# Altium schematic sheet 01_Power.SchDoc
size A4; SheetNumber: 1; SheetTotal: 5
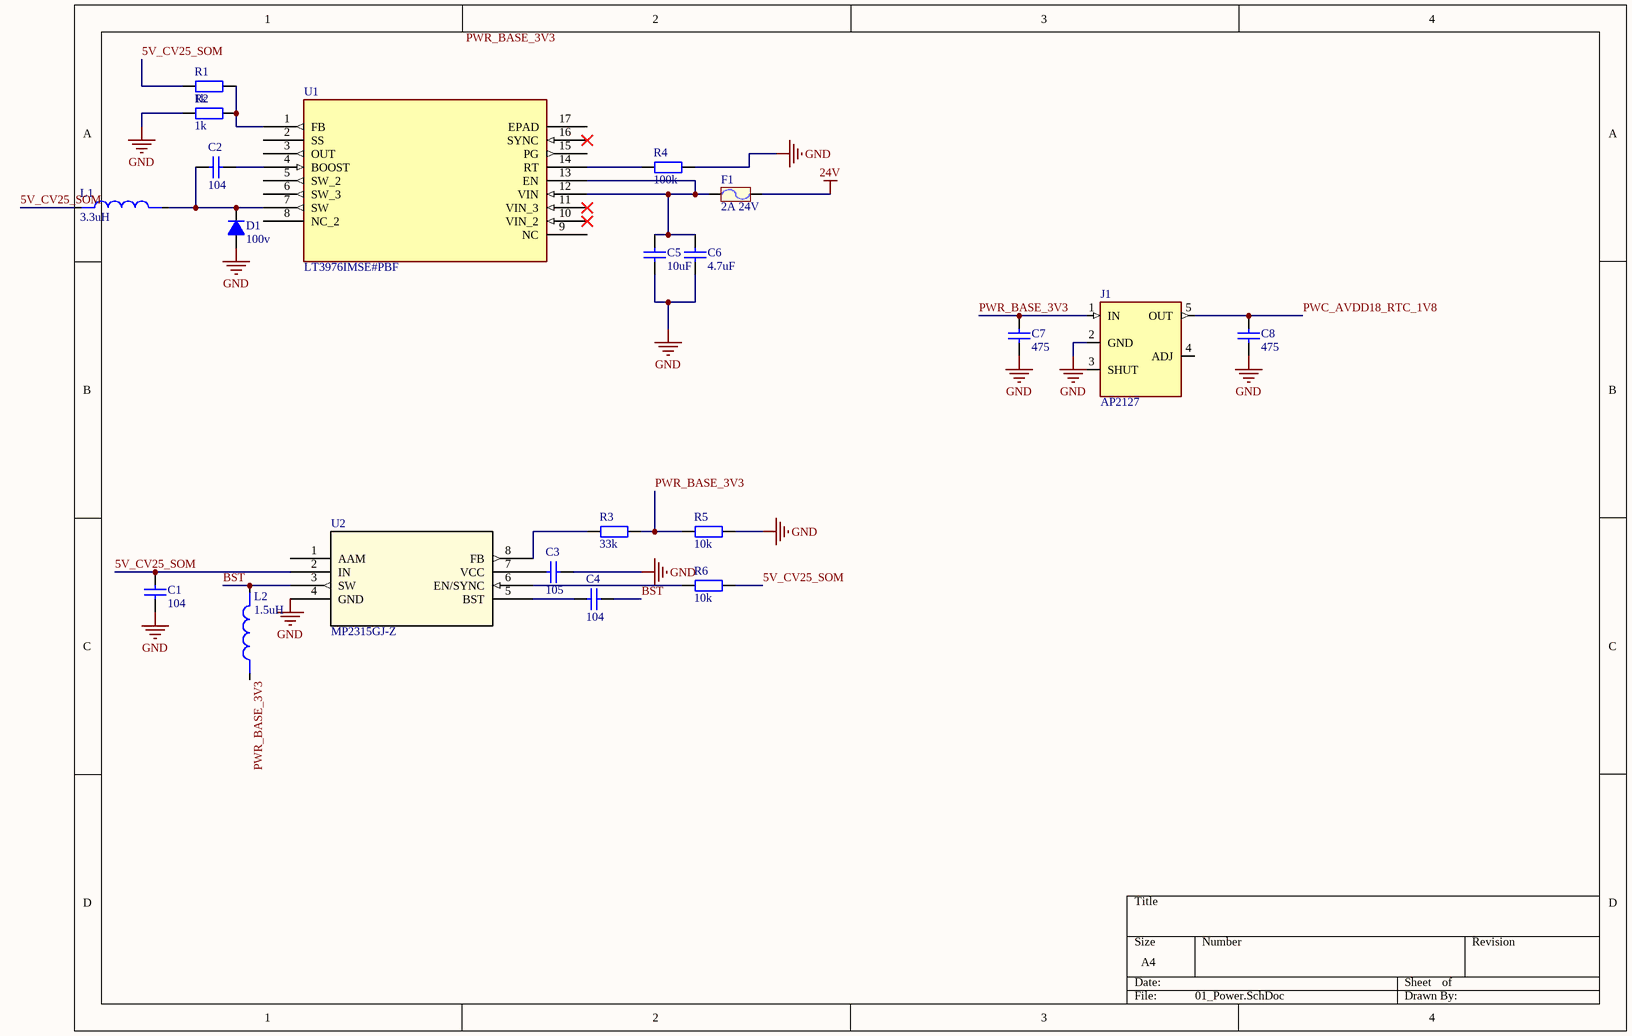
[diagram p0: 01_Power.SchDoc]

## Parts
C1  104  [tu 0603]
C2  104  [tu 0603]
C3  105  [tu 0603]
C4  104  [tu 0603]
C5  10uF  [tu 0603]
C6  4.7uF  [tu 0603]
C7  475  [tu 0805]
C8  475  [tu 0805]
D1  100v  [DIODE 1A]
F1  2A 24V  [Cau chi tu phuc hoi 2A 24V SMD1812]
J1  AP2127  [AP2127K-3.3]
L1  3.3uH  [CUON CAM SMD 0530]
L2  1.5uH  [CUON CAM SMD 0530]
R1  1k  [tro smd 0603]
R2  1k  [tro smd 0603]
R3  33k  [Tro smd 0603]
R4  100k  [tro smd 0805]
R5  10k  [tro smd 0603]
R6  10k  [tro smd 0603]
U1  LT3976IMSE#PBF  [MSOP-16_MSE]
U2  MP2315GJ-Z  [TSOT23-8_MPS]

## Nets
24V: F1.2
GND: C1.2 C3.1 C5.1 C6.1 C7.2 C8.2 D1.1(A) J1.2(GND) R2.1 R4.2 R5.2 U2.4(GND)
5V_CV25_SOM: C1.1 L1.1 R1.1 R6.2 U2.2(IN)
BST: C4.1 L2.2 U2.3(SW)
PWC_AVDD18_RTC_1V8: C8.1 J1.5(OUT)
PWR_BASE_3V3: C7.1 J1.1(IN) L2.1 R3.2 R5.1
NetC2_1: C2.1 U1.4(BOOST)
NetC2_2: C2.2 D1.2(K) L1.2 U1.7(SW)
NetC3_2: C3.2 U2.7(VCC)
NetC4_2: C4.2 U2.5(BST)
NetC5_2: C5.2 C6.2 F1.1 U1.12(VIN) U1.13(EN)
NetR1_2: R1.2 R2.2 U1.1(FB)
NetR3_1: R3.1 U2.8(FB)
NetR4_1: R4.1 U1.14(RT)
NetR6_1: R6.1 U2.6(EN/SYNC)

Not connected (* = marked no-connect by the designer): J1 3(SHUT) 4(ADJ); U1 2(SS) 3(OUT) 5(SW_2) 6(SW_3) 8(NC_2) 9(NC) 10(VIN_2)* 11(VIN_3)* 15(PG) 16(SYNC)* 17(EPAD); U2 1(AAM)

## Notes on the sheet
- Labels drawn without touching a wire or pin: PWR_BASE_3V3

## Library data of the parts
C1 C2 C4 = Tu 0603 104 50V 10%: Dán; Don_Vi: Con; So_Chan: 2; Ten_Linh_Kien: Tụ 0603 104-100nF 10% 50V; Ma_Hang: MH004568; Chung_Loai: Dán; Kieu_Chan: *
C3 = Tu 0603 105 16V 20%: Dán; Don_Vi: Con; So_Chan: 2; Ten_Linh_Kien: Tụ 0603 105-1uF 20% 16V; Ma_Hang: MH004574; Chung_Loai: Dán; Kieu_Chan: *
C5 C6 = Tu 0603 470pF 50V 10%: Dán; Don_Vi: Con; So_Chan: 2; Ten_Linh_Kien: Tụ 0603 470P 50V 10%; Ma_Hang: MH004571; Chung_Loai: Dán; Kieu_Chan: *
C7 C8 = Tu 0805 475 25V 20%: Dán; Don_Vi: Con; So_Chan: 2; Ten_Linh_Kien: Tụ 0805 475-4.7uF 20% 25V; Ma_Hang: MH004276; Chung_Loai: Dán; Kieu_Chan: *
D1 = Diode 1N4007: Cắm; Ten_Linh_Kien: Diode 1N4007 1A (DIP); Don_Vi: Con; Ma_Hang: MH001063; Ghi Chu: *; Kieu_Chan: *; Chung_Loai: Cắm
F1 = Cau chi tu phuc hoi 2A 24V SMD1812: 2A 24V SMD1812; Ma_Hang: MH010033; Ten: Cầu Chì Tự Phục Hồi 2A 24V SMD1812
J1 = AP2127: LDO Regulator Pos 1.8V 0.4A 5-Pin SOT-23 T/R / IC REG LDO 1.8V 0.3A SOT23-5; MF: Diodes Incorporated; SnapEDA_Link: https://www.snapeda.com/parts/AP2127/EDTM+Incorporated/view-part/?ref=snap; Package: None; Value: *; MP: AP2127; Check_prices: https://www.snapeda.com/parts/AP2127/EDTM+Incorporated/view-part/?ref=eda
L1 L2 = Cuon Cam SMD 0530: SMD 0530; MP: FDV0530-H-1R5M=P3; Package: None; Price: None; Value: *; Availability: Unavailable
R1 R2 = Tro 0603 1% 1k: Dán; So_Chan: 2; Don_Vi: Con; Ten_Linh_Kien: Trở 0603 1% 1k; Ma_Hang: MH006334; Chung_Loai: Dán; Kieu_Chan: *
R3 = Tro 0603 1% 33k: Dán; Don_Vi: Con; So_Chan: 2; Ten_Linh_Kien: Trở 0603 1% 33k; Ma_Hang: MH006335; Chung_Loai: Dán; Kieu_Chan: *
R4 = Tro 0805 5% 100k: Dán; Don_Vi: Con; So_Chan: 2; Ten_Linh_Kien: Trở 0805 5% 100k; Ma_Hang: MH005250; Chung_Loai: Dán; Kieu_Chan: *
R5 R6 = Tro 0603 1% 10k: Dán; Don_Vi: Con; So_Chan: 2; Ten_Linh_Kien: Trở 0603 1% 10k; Ma_Hang: MH006333; Chung_Loai: Dán; Kieu_Chan: *
U1 = LT3976IMSE#PBF: 40V, 5A, 2MHz Step-Down Switching Regulator with 3.3Î¼A Quiescent Current; MF: Analog Devices; Value: *; Price: None; Package: MSOP -16 Analog Devices; MP: LT3976IMSE#PBF; Purchase-URL: https://pricing.snapeda.com/search/part/LT3976IMSE#PBF/?ref=eda; SnapEDA_Link: https://www.snapeda.com/parts/LT3976IMSE%23PBF/Analog+Devices/view-part/?ref=snap; Check_prices: https://www.snapeda.com/parts/LT3976IMSE%23PBF/Analog+Devices/view-part/?ref=eda; Availability: In Stock
U2 = MP2315GJ-Z: High Efficiency 3A 24V 500kHz with AAM (light load mode) Synchronous Step Down Converter in TSOT23-8; Manufacturer_Name: Monolithic Power Systems; Copyright: Copyright (C) 2026 Ultra Librarian. All rights reserved.; Manufacturer_Part_Number: MP2315GJ-Z; RefDes: RefDes; Type: Type